# Altium project DM3370.PrjPcb (part 9 of 14)
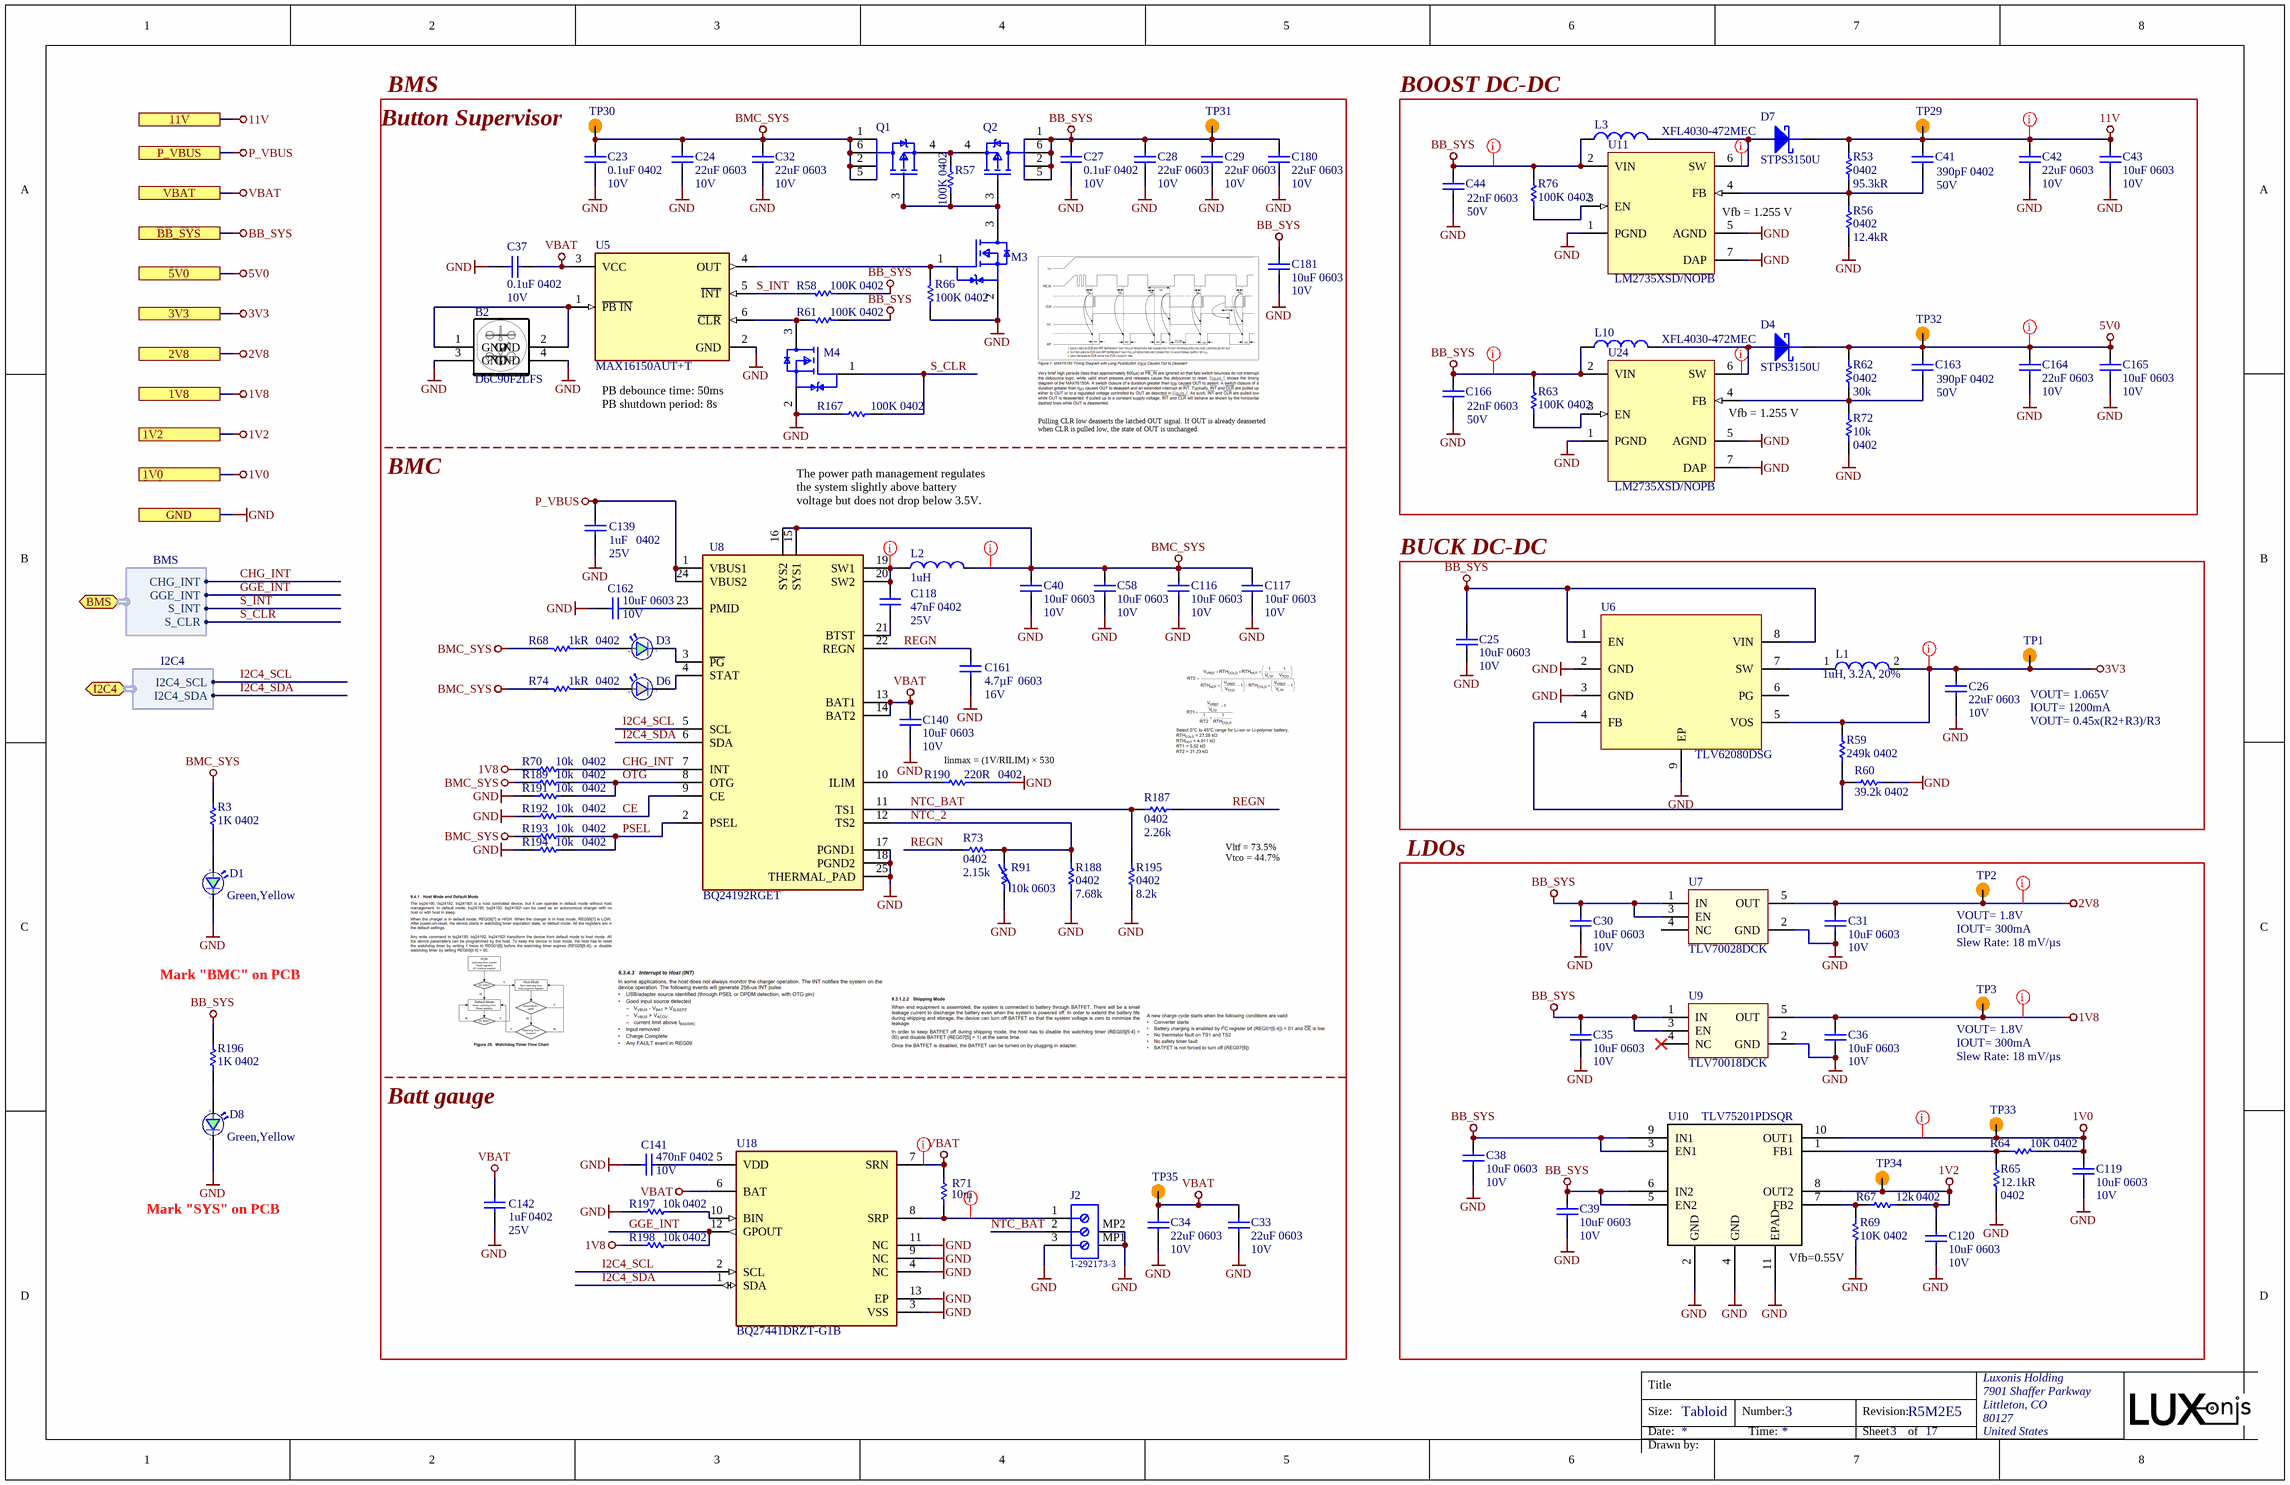
[diagram p117: DM3370_Power.SchDoc]

## Sheet DM3370_Power.SchDoc: =project_title (continued)
### Library data of the parts
B2 = CMP-002-00091-3: Keypad Switch, 1 Switches, SPST, Momentary-tactile, 0.1A, 32VDC, 2.5N, 4 PCB Hole Cnt, Solder Terminal, Through Hole-straight; Manufacturer Series: D6C; Manufacturer 1: C&K; Electrical Life: 250000Cycles; Actuator Type: SQUARE TYPE; Number of Switches: 1; Circuit Configuration: 1X1; Connector Type: Receptacle; Contact Bounce Time-Max: 10ms; Body Height: 5.8mm; Contact DC Max Rating R Load: .1A@32VDC; Body Length or Diameter: 12mm; Contact Current(DC)-Max: 100mA; Contact Voltage(DC)-Max: 32V; Manufacturer Part Number 1: D6C90F2LFS; Operating Force-Max: 2.5N; RoHS Compliant: No; Min Operating Temperature: -20°C; Switch Type: Keypad; Packaging: Bulk; REACH SVHC: No SVHC; Max Operating Temperature: 85°C; Switch Function: SPST; Termination: Solder; Switch Action: MOMENTARY-TACTILE; Mount: Through Hole
C23 C27 C37 = GRM155R71A104JA01D: CAP CER 0.1UF 10V X7R 0402 5%; Manufacturer 1: Murata; Capacitance: 100nF; Supplier 1: Digi-Key; Manufacturer Part Number 1: GRM155R71A104JA01D; Stock 1: 1346709; Pricing 1: 1=0.10000, 10=0.02500, 100=0.01130, 500=0.00806, 1000=0.00633, 2500=0.00575, 5000=0.00529 (USD); RoHS: Yes; Mount: Surface Mount; Case/Package: 0402; Case Code (Imperial): 0402; Case Code (Metric): 1005; Min Operating Temperature: -55°C; Max Operating Temperature: 125°C; Tolerance: 5%; Packaging: Tape and Reel; Voltage Rating (DC): 10V; Dielectric: X7R; Package Quantity: 10000; Termination: SMD/SMT; Length: 1mm; Height: 0.5mm; Width: 0.02inch; Thickness: 0.022inch; Depth: 0.5mm; Radiation Hardening: No; Lead Free: Lead Free; ComponentLink1URL: https://datasheet.ciiva.com/5411/product-5411135.pdf?src-supplier=Mouser; ComponentLink1Description: https://datasheet.ciiva.com/5411/product-5411135.pdf?src-supplier=Mouser; ComponentLink2URL: https://datasheet.ciiva.com/11618/c02e-11618821.pdf?src-supplier=Avnet; ComponentLink2Description: https://datasheet.ciiva.com/11618/c02e-11618821.pdf?src-supplier=Avnet; Supplier Part Number 1: 490-10777-1-ND
C24 C26 C28 C29 C32-C34 C42 C164 C180 = GRM188R61A226ME15D: CAP CER 22UF 10V X5R 0603 20%; Manufacturer 1: Murata; Material: Ceramic; ComponentLink1URL: https://datasheet.ciiva.com/46444/1769893-46444975.pdf?src-supplier=Element14; ComponentLink1Description: https://datasheet.ciiva.com/46444/1769893-46444975.pdf?src-supplier=Element14; Supplier 1: Digi-Key; Manufacturer Part Number 1: GRM188R61A226ME15D; Stock 1: 984716; Pricing 1: 1=0.31000, 10=0.21500, 100=0.12160, 500=0.08584, 1000=0.07512 (USD); RoHS: Yes; Mount: Surface Mount; Case/Package: 0603; Weight: 0.000222oz; Case Code (Metric): 1608; Case Code (Imperial): 0603; Min Operating Temperature: -55°C; Max Operating Temperature: 85°C; Capacitance: 22uF; Tolerance: 20%; Packaging: Tape and Reel; Dielectric: X5R; Voltage Rating (DC): 10V; Termination: SMD/SMT; Package Quantity: 4000; Length: 1.6mm; Height: 0.8mm; Width: 0.8mm; Thickness: 0.039inch; Depth: 0.8mm; REACH SVHC: No SVHC; Lead Free: Lead Free; Supplier Part Number 1: 490-10476-1-ND
C25 C30 C31 C35 C36 C38-C40 C43 C58 C116 C117 C119 C120 C140 C162 C165 C181 = GRM188R61A106ME69D: CAP CER 10UF 10V X5R 0603 20%; Manufacturer 1: Murata; Material: Ceramic; Supplier 1: Digi-Key; Manufacturer Part Number 1: GRM188R61A106ME69D; Stock 1: 2873098; Pricing 1: 1=0.21000, 10=0.14100, 100=0.07130, 500=0.04876, 1000=0.04313 (USD); RoHS: Yes; Mount: Surface Mount; Case/Package: 0603; Weight: 0.000222oz; Case Code (Metric): 1608; Case Code (Imperial): 0603; Min Operating Temperature: -55°C; Max Operating Temperature: 85°C; Packaging: Tape and Reel; Tolerance: 20%; Capacitance: 10uF; Dielectric: X5R; Voltage Rating (DC): 10V; Package Quantity: 4000; Termination: SMD/SMT; Length: 1.6mm; Height: 0.8mm; Width: 0.8mm; Thickness: 0.035inch; Depth: 0.8mm; REACH SVHC: Unknown; Lead Free: Lead Free; ComponentLink1URL: http://www.mouser.com/ds/2/281/c02e-2905.pdf?src-supplier=Mouser; ComponentLink1Description: http://www.mouser.com/ds/2/281/c02e-2905.pdf?src-supplier=Mouser; ComponentLink2URL: http://components.arrow.com/part/dataview/0323_06119472?src-supplier=Arrow+Europe; ComponentLink2Description: http://components.arrow.com/part/dataview/0323_06119472?src-supplier=Arrow+Europe; ComponentLink3URL: http://www.farnell.com/datasheets/2048014.pdf?src-supplier=Farnell; ComponentLink3Description: http://www.farnell.com/datasheets/2048014.pdf?src-supplier=Farnell; ComponentLink4URL: http://www.farnell.com/datasheets/1872210.pdf?src-supplier=Farnell; ComponentLink4Description: http://www.farnell.com/datasheets/1872210.pdf?src-supplier=Farnell; ComponentLink5URL: http://search.murata.co.jp/Ceramy/image/img/A01X/G101/ENG/GRM188R61A106ME69-01.pdf?src-supplier=Digi-Key; ComponentLink5Description: http://search.murata.co.jp/Ceramy/image/img/A01X/G101/ENG/GRM188R61A106ME69-01.pdf?src-supplier=Digi-Key; ComponentLink6URL: http://www.farnell.com/datasheets/1872210.pdf?src-supplier=Newark; ComponentLink6Description: http://www.farnell.com/datasheets/1872210.pdf?src-supplier=Newark; ComponentLink7URL: http://www.farnell.com/datasheets/2048014.pdf?src-supplier=Element14; ComponentLink7Description: http://www.farnell.com/datasheets/2048014.pdf?src-supplier=Element14; ComponentLink8URL: http://www.farnell.com/datasheets/2048014.pdf?src-supplier=Newark; ComponentLink8Description: http://www.farnell.com/datasheets/2048014.pdf?src-supplier=Newark; Supplier Part Number 1: 490-10475-1-ND
C41 C163 = CMP-004-000029-1: CAP CER 390PF 50V C0G 0402; Manufacturer 1: Murata; Negative Tolerance: 5%; Capacitor Type: Ceramic; Multilayer: Yes; RoHS Compliant: Yes; Packaging: Tape and Reel; Width: 0.5mm; ComponentLink2URL: https://datasheet.ciiva.com/6270/product-6270768.pdf?src-supplier=Digi-Key; Category: Ceramic Capacitors; Height: 0.5mm; Design Item ID: GRM1555C1H391JA01J; RoHS: Yes; ComponentLink3Description: https://datasheet.ciiva.com/6270/partnumbering-e-01-6270809.pdf?src-supplier=Digi-Key; Manufacturer Part Number 1: GRM1555C1H391JA01J; Max Operating Temperature: 125°C; Length: 1mm; Dielectric Material: Ceramic; JESD-609 Code: e3; REACH SVHC: Yes; Mount: Surface Mount; Source: LuxonisMaster.SchLib; ComponentLink2Description: https://datasheet.ciiva.com/6270/product-6270768.pdf?src-supplier=Digi-Key; Termination: Wraparound; Terminal Finish: Nickel; ComponentLink3URL: https://datasheet.ciiva.com/6270/partnumbering-e-01-6270809.pdf?src-supplier=Digi-Key; Positive Tolerance: 5%; ComponentLink1Description: https://datasheet.ciiva.com:443/pdfs/VipMasterIC/IC/MURE/MURE-S-A0004280628/MURE-S-A0004346975-1.pdf?src-supplier=IHS+Markit; Pricing 1: 1=0,10000, 10=0,07100, 50=0,03900, 100=0,03180, 500=0,02272, 1000=0,01785, 2500=0,01622, 5000=0,01493 (USD); Package Style: SMTMeter; Temperature Characteristics Code: C0G; Number of Pins: 2; Package Shape: Rectangular; Stock 1: 73655; ComponentLink1URL: https://datasheet.ciiva.com:443/pdfs/VipMasterIC/IC/MURE/MURE-S-A0004280628/MURE-S-A0004346975-1.pdf?src-supplier=IHS+Markit; Min Operating Temperature: -55°C
C44 C166 = CMP-004-000000-1: CAP CER 0.022UF 50V X7R 0603; Manufacturer 1: KEMET; Dissipation Factor: 2.5%; Dielectric Material: Ceramic; Tolerance: 10%; Depth: 0.8mm; Package Quantity: 4000; Radiation Hardening: No; ComponentLink1Description: https://datasheet.ciiva.com/7823/1776091-7823698.pdf?src-supplier=Element14; Min Operating Temperature: -55°C; ComponentLink2URL: https://datasheet.ciiva.com/7824/kem-c1002-x7r-smd-7824021.pdf?src-supplier=Element14; Manufacturer Part Number 1: C0603C223K5RACTU; Mount: Surface Mount,PCB; Height: 0.8mm; Case Code (Metric): 1608; REACH SVHC: No SVHC; Width: 0.8mm; ComponentLink1URL: https://datasheet.ciiva.com/7823/1776091-7823698.pdf?src-supplier=Element14; ComponentLink2Description: https://datasheet.ciiva.com/7824/kem-c1002-x7r-smd-7824021.pdf?src-supplier=Element14; RoHS: Yes; Contact Plating: Tin,Matte; Stock 1: 77845; Dielectric: X7R; Thickness: 0.034inch; Source: LuxonisMaster.SchLib; Voltage: 50V; Voltage Rating (DC): 50V; Design Item ID: C0603C223K5RACTU; Number of Pins: 2; Case/Package: 0603; Length: 1.6mm; Pricing 1: 1=0.10000, 10=0.06400, 100=0.02850, 500=0.02036, 1000=0.01600 (USD); Packaging: Tape and Reel; Lead Pitch: 0.7mm; Max Operating Temperature: 125°C; Termination: SMD/SMT
C118 = CMP-004-000014-1: CAP CER 0.047UF 25V X7R 0402 10%; Manufacturer 1: Murata; Material: Ceramic; Voltage Rating: 25V; Manufacturer Part Number: GRM155R71E473KA88D; Manufacturer Part Number 1: GRM155R71E473KA88D; ComponentLink11Description: https://datasheet.ciiva.com/5424/product-5424844.pdf?src-supplier=Mouser; ComponentLink11URL: https://datasheet.ciiva.com/5424/product-5424844.pdf?src-supplier=Mouser; ComponentLink4Description: https://datasheet.ciiva.com/18184/getdatasheetpartid-153136-18184712.pdf?src-supplier=Verical; Thickness: 0.022inch; ComponentLink3Description: https://datasheet.ciiva.com/34302/1856425-34302854.pdf?src-supplier=Jameco; ComponentLink5Description: https://datasheet.ciiva.com/29199/454180-da-01-en-vs-kondensator-0402-29199826.pdf?src-supplier=Conrad; RoHS: Yes; Package Quantity: 1; Manufacturer: Murata; ComponentLink12Description: https://datasheet.ciiva.com/16213/product-16213823.pdf?src-supplier=Future+Electronics; REACH SVHC: No SVHC; ComponentLink12URL: https://datasheet.ciiva.com/16213/product-16213823.pdf?src-supplier=Future+Electronics; Source: LuxonisMaster.SchLib; Width: 0.02inch; ComponentLink5URL: https://datasheet.ciiva.com/29199/454180-da-01-en-vs-kondensator-0402-29199826.pdf?src-supplier=Conrad; Case Code (Metric): 1005; Stock 1: 1130633; Radiation Hardening: No; ComponentLink9URL: https://datasheet.ciiva.com/7937/608985-7937623.pdf?src-supplier=Element14; ComponentLink2Description: https://datasheet.ciiva.com/131/grm155r71e473ka88-01-131494.pdf?src-supplier=Digi-Key; Tolerance: 10%; Case/Package: 0402; Termination: SMD/SMT; Pricing 1: 1=0.10000, 10=0.06300, 100=0.02820, 500=0.02012, 1000=0.01581, 2500=0.01438, 5000=0.01323 (USD); ComponentLink10URL: https://datasheet.ciiva.com/14103/grmseries-highdielectrictype-eng-14103754.pdf?src-supplier=Distrelec; ComponentLink3URL: https://datasheet.ciiva.com/34302/1856425-34302854.pdf?src-supplier=Jameco; Min Operating Temperature: -55°C; Lead Free: Lead Free; Dielectric: X7R; ComponentLink8URL: https://datasheet.ciiva.com/131/grm155r71e473ka88-01-131493.pdf?src-supplier=Digi-Key; Packaging: Tape and Reel; ComponentLink7URL: https://datasheet.ciiva.com/131/grm155r71e473ka88-01-131492.pdf?src-supplier=Digi-Key; ComponentLink6URL: https://datasheet.ciiva.com/2989/product-2989395.pdf?src-supplier=Avnet; ComponentLink7Description: https://datasheet.ciiva.com/131/grm155r71e473ka88-01-131492.pdf?src-supplier=Digi-Key; Mount: Surface Mount; ComponentLink4URL: https://datasheet.ciiva.com/18184/getdatasheetpartid-153136-18184712.pdf?src-supplier=Verical; Length: 1mm; Design Item ID: GRM155R71E473KA88D; ComponentLink10Description: https://datasheet.ciiva.com/14103/grmseries-highdielectrictype-eng-14103754.pdf?src-supplier=Distrelec; ComponentLink6Description: https://datasheet.ciiva.com/2989/product-2989395.pdf?src-supplier=Avnet; Height: 0.5mm; Voltage Rating (DC): 25V; ComponentLink1URL: https://datasheet.ciiva.com/17455/product-17455616.pdf?src-supplier=Avnet+Europe; Max Operating Temperature: 125°C; ComponentLink1Description: https://datasheet.ciiva.com/17455/product-17455616.pdf?src-supplier=Avnet+Europe; ComponentLink2URL: https://datasheet.ciiva.com/131/grm155r71e473ka88-01-131494.pdf?src-supplier=Digi-Key; Number of Pins: 2; Depth: 0.5mm; ComponentLink8Description: https://datasheet.ciiva.com/131/grm155r71e473ka88-01-131493.pdf?src-supplier=Digi-Key; ComponentLink9Description: https://datasheet.ciiva.com/7937/608985-7937623.pdf?src-supplier=Element14
C139 C142 = CMP-108-000014-1: CAP CER 1UF 25V X5R 0402 10%; Manufacturer 1: Murata; Material: Ceramic; Voltage Rating: 25V; Package Quantity: 10000; Width: 0.5mm; Termination: SMD/SMT; RoHS: Yes; Dielectric: X5R; Min Operating Temperature: -55°C; Packaging: Tape and Reel; ComponentLink1URL: https://datasheet.ciiva.com/22732/1666664-22732122.pdf?src-supplier=Element14; Thickness: 0.022inch; ComponentLink1Description: https://datasheet.ciiva.com/22732/1666664-22732122.pdf?src-supplier=Element14; ComponentLink2Description: https://datasheet.ciiva.com/7719/1666664-7719006.pdf?src-supplier=Element14; Case Code (Metric): 1005; Mount: Surface Mount; Weight: 0.000212oz; Tolerance: 10%; Length: 1mm; Max Operating Temperature: 85°C; Source: BW2098POE_1.SCHLIB; ComponentLink2URL: https://datasheet.ciiva.com/7719/1666664-7719006.pdf?src-supplier=Element14; Depth: 0.5mm; Case/Package: 0402; Manufacturer Part Number 1: GRM155R61E105KA12D; Voltage Rating (DC): 25V; Pricing 1: 1=0.10000, 10=0.07100, 100=0.03350, 500=0.02352, 1000=0.01947, 2500=0.01812, 5000=0.01658 (USD); REACH SVHC: No SVHC; Lead Free: Lead Free; Design Item ID: GRM155R61E105KA12D; Stock 1: 200653; Height: 0.5mm
C141 = CMP-004-000030-1: CAP CER 0.47UF 10V X5R 0402; Manufacturer 1: Murata; Tolerance: 10%; Material: Ceramic; Dissipation Factor: 0.1%; ComponentLink3URL: https://datasheet.ciiva.com/11786/0900766b80ef921d-11786226.pdf?src-supplier=RSComponents; Series: GRM; ComponentLink7URL: https://datasheet.ciiva.com/7719/1747445-7719005.pdf?src-supplier=Element14; Length: 1mm; ComponentLink5Description: https://datasheet.ciiva.com/29200/453533-da-01-en-vs-kondensator-0402-29200100.pdf?src-supplier=Conrad; ComponentLink6URL: https://datasheet.ciiva.com/14116/grmseries-highdielectrictype-eng-14116874.pdf?src-supplier=Distrelec; Height: 0.5mm; ComponentLink2Description: https://datasheet.ciiva.com/164/product-164992.pdf?src-supplier=Digi-Key; Mount: Surface Mount; ComponentLink11Description: https://datasheet.ciiva.com/2989/product-2989371.pdf?src-supplier=Avnet; ComponentLink12URL: https://datasheet.ciiva.com/16199/product-16199863.pdf?src-supplier=Future+Electronics; ComponentLink6Description: https://datasheet.ciiva.com/14116/grmseries-highdielectrictype-eng-14116874.pdf?src-supplier=Distrelec; ComponentLink12Description: https://datasheet.ciiva.com/16199/product-16199863.pdf?src-supplier=Future+Electronics; Source: LuxonisMaster.SchLib; Lead Free: Lead Free; ComponentLink10Description: https://datasheet.ciiva.com/164/grm155r61a474ke15-01-164994.pdf?src-supplier=Digi-Key; REACH SVHC: No SVHC; Package Quantity: 10000; Design Item ID: GRM155R61A474KE15D; ComponentLink4URL: https://datasheet.ciiva.com/18184/getdatasheetpartid-137366-18184609.pdf?src-supplier=Verical; ComponentLink9Description: https://datasheet.ciiva.com/164/grm155r61a474ke15-01-164993.pdf?src-supplier=Digi-Key; ComponentLink4Description: https://datasheet.ciiva.com/18184/getdatasheetpartid-137366-18184609.pdf?src-supplier=Verical; ComponentLink1URL: https://datasheet.ciiva.com/6068/1747445-6068308.pdf?src-supplier=Farnell; Case Code (Metric): 1005; ComponentLink3Description: https://datasheet.ciiva.com/11786/0900766b80ef921d-11786226.pdf?src-supplier=RSComponents; RoHS Compliant: Yes; Construction: Flat; ComponentLink9URL: https://datasheet.ciiva.com/164/grm155r61a474ke15-01-164993.pdf?src-supplier=Digi-Key; Stock 1: 10000; Width: 0.02inch; Pricing 1: 10000=0,01214, 20000=0,01179, 40000=0,01144 (USD); Min Operating Temperature: -55°C; ComponentLink7Description: https://datasheet.ciiva.com/7719/1747445-7719005.pdf?src-supplier=Element14; Voltage Rating (DC): 10V; Case Code (Imperial): 0402; Voltage: 10V; Manufacturer Part Number 1: GRM155R61A474KE15D; Category: Ceramic Capacitors; ComponentLink11URL: https://datasheet.ciiva.com/2989/product-2989371.pdf?src-supplier=Avnet; Number of Pins: 2; ComponentLink2URL: https://datasheet.ciiva.com/164/product-164992.pdf?src-supplier=Digi-Key; ComponentLink5URL: https://datasheet.ciiva.com/29200/453533-da-01-en-vs-kondensator-0402-29200100.pdf?src-supplier=Conrad; Radiation Hardening: No; Max Operating Temperature: 85°C; ComponentLink8URL: https://datasheet.ciiva.com/22698/1747445-22698412.pdf?src-supplier=Element14; ComponentLink8Description: https://datasheet.ciiva.com/22698/1747445-22698412.pdf?src-supplier=Element14; ComponentLink10URL: https://datasheet.ciiva.com/164/grm155r61a474ke15-01-164994.pdf?src-supplier=Digi-Key; Thickness: 0.022inch; ComponentLink1Description: https://datasheet.ciiva.com/6068/1747445-6068308.pdf?src-supplier=Farnell; Termination: SMD/SMT; Depth: 0.5mm; Packaging: Tape and Reel; Dielectric: X5R; RoHS: Yes
C161 = CMP-004-000020-2: CAP CER 4.7UF 16V X5R 0603 10%; Manufacturer 1: Murata; Manufacturer Part Number 1: GRM188R61C475KAAJD; Tolerance: 10%; Design Item ID: GRM188R61C475KAAJD; Manufacturer 2: Murata; Height: 0.8mm; ComponentLink1Description: https://datasheet.ciiva.com/14813/595grm188r61c475kaaj23-14813668.pdf?src-supplier=Arrow; Manufacturer 3: Murata; ComponentLink1URL: https://datasheet.ciiva.com/14813/595grm188r61c475kaaj23-14813668.pdf?src-supplier=Arrow; Dielectric: X5R; Manufacturer Part Number 3: GRM188R61C475KAAJD; Depth: 0.8mm; Max Operating Temperature: 85°C; Manufacturer Part Number 2: GRM188R61C475KAAJD; Length: 1.6mm; Width: 0.8mm; Min Operating Temperature: -55°C; Mounting Technology: SMT
D1 D8 = CMP-111-000004-2: LED GREEN DIFFUSED 0603 SMD Green 572nm LED Indication - Discrete 2.2V 0603 (1608 Metric); Manufacturer 1: Rohm; Forward Current: 20mA; Min Operating Temperature: -40°C; Forward Voltage: 2.2V; Max Operating Temperature: 85°C; Case/Package: 0603; Manufacturer Part Number 1: SML-D12M8WT86
D3 = CMP-111-000004-1: LED GREEN DIFFUSED 0603 SMD Green 572nm LED Indication - Discrete 2.2V 0603 (1608 Metric); Manufacturer 1: Rohm; Test Current: 20mA; Viewing Angle: 160°; Lens Color: White,Diffused; Colour: Green,Yellow; Lens Style: Diffused,Colorless,Rectangular; Luminous Intensity: 25mcd; Lens Colour: White,Clear,Diffused; Number of LEDs: 1; ComponentLink10Description: https://datasheet.ciiva.com/2110/sml-d1-2110398.pdf?src-supplier=Digi-Key; Case Code (Imperial): 0603; Packaging: Tape and Reel; Mount: Surface Mount; Illumination Colour: Green; Min Operating Temperature: -40°C; ComponentLink5URL: https://datasheet.ciiva.com/2110/sml-d1-2110398.pdf; ComponentLink4Description: https://datasheet.ciiva.com/2110/sml-d1-2110397.pdf; Forward Current: 20mA; ComponentLink6URL: https://datasheet.ciiva.com/11774/0900766b80df3ada-11774260.pdf?src-supplier=RSComponents; Width: 0.8mm; Dominant Wavelength: 572nm; RoHS: Yes; ComponentLink7URL: https://datasheet.ciiva.com/3161/sml-d1-3161419.pdf?src-supplier=Avnet; Number of Pins: 2; ComponentLink1URL: https://datasheet.ciiva.com/11774/0900766b80df3ada-11774260.pdf; ComponentLink10URL: https://datasheet.ciiva.com/2110/sml-d1-2110398.pdf?src-supplier=Digi-Key; ComponentLink2Description: https://datasheet.ciiva.com/3161/sml-d1-3161419.pdf; Package Quantity: 1; Manufacturer Part Number 1: SML-D12M8WT86; Lens Transparency: Diffused; Height: 0.65mm; Case/Package: 0603; Manufacturer Part Number: SML-D12M8WT86; ComponentLink2URL: https://datasheet.ciiva.com/3161/sml-d1-3161419.pdf; ComponentLink9Description: https://datasheet.ciiva.com/2110/sml-d1-2110397.pdf?src-supplier=Digi-Key; Pricing 1: 1=0.33000, 10=0.23900, 100=0.11340, 500=0.07560, 1000=0.05922 (USD); ComponentLink8URL: https://datasheet.ciiva.com/2110/sml-d1-2110396.pdf?src-supplier=Digi-Key; ComponentLink7Description: https://datasheet.ciiva.com/3161/sml-d1-3161419.pdf?src-supplier=Avnet; Lead Free: Lead Free; Wavelength: 572nm; ComponentLink8Description: https://datasheet.ciiva.com/2110/sml-d1-2110396.pdf?src-supplier=Digi-Key; ComponentLink9URL: https://datasheet.ciiva.com/2110/sml-d1-2110397.pdf?src-supplier=Digi-Key; Source: BW2098POE_1.SCHLIB; Max Operating Temperature: 85°C; ComponentLink4URL: https://datasheet.ciiva.com/2110/sml-d1-2110397.pdf; ComponentLink1Description: https://datasheet.ciiva.com/11774/0900766b80df3ada-11774260.pdf; ComponentLink3URL: https://datasheet.ciiva.com/2110/sml-d1-2110396.pdf; Design Item ID: SML-D12M8WT86; Color: Green,Yellow; Manufacturer: Rohm; Radiation Hardening: No; Illumination Color: Green; ComponentLink3Description: https://datasheet.ciiva.com/2110/sml-d1-2110396.pdf; ComponentLink6Description: https://datasheet.ciiva.com/11774/0900766b80df3ada-11774260.pdf?src-supplier=RSComponents; Stock 1: 112971; Length: 1.6mm; Case Code (Metric): 1608; ComponentLink5Description: https://datasheet.ciiva.com/2110/sml-d1-2110398.pdf; Forward Voltage: 2.2V; REACH SVHC: Unknown
D4 D7 = STPS3150U: DIODE SCHOTTKY 150V 3A SMB; Manufacturer 1: STMicroelectronics; Standoff Height: 0.05mm; Max Junction Temp: +175°C; Peak Reverse Current: 0.4uA; Max Surge Forward Current: 80A; Max Repetitive Reverse Voltage: 150V; Device Class L3: Schottky Diodes; Temperature Range High: +175°C; Digikey Description: DIODE SCHOTTKY 150V 3A SMB; ComponentLink2Description: Datasheet; ComponentLink2URL: https://www.st.com/resource/en/datasheet/stps3150.pdf; Category: Diode; Manufacturer Part Number 1: STPS3150U; Package: SMB; Mouser Description: Schottky Diodes & Rectifiers 3.0 Amp 150 Volt; Octopart: https://octopart.com/stps3150u-stmicroelectronics-39552976; Temperature: to +175°C; Device Class L2: Diodes; Height: 2.65mm; RoHS: TRUE; Lead Free: Yes; Forward Current: 3A; Device Class L1: Discrete Semiconductors; Automotive: No; Manufacturer: STMicroelectronics; Manufacturer Part Number: STPS3150U
D6 = CMP-111-000003-1: LED ORANGE DIFFUSED 0603 SMD Orange 605nm LED Indication - Discrete 2.2V 0603 (1608 Metric); Manufacturer 1: Rohm; Lens Style: Diffused,Colorless,Rectangular; Forward Current: 20mA; Luminous Intensity: 100mcd; Number of LEDs: 1; Viewing Angle: 160°; Lens Color: White; Design Item ID: SML-D12D8WT86; ComponentLink6Description: https://datasheet.ciiva.com/17419/sml-d1-17419886.pdf?src-supplier=Avnet+Europe; Number of Pins: 2; ComponentLink5Description: https://datasheet.ciiva.com/2115/sml-d1-2115579.pdf?src-supplier=Digi-Key; Manufacturer Part Number 1: SML-D12D8WT86; Min Operating Temperature: -40°C; Illumination Color: Orange; Pricing 1: 1=0.33000, 10=0.23900, 100=0.11340, 500=0.07560, 1000=0.05922 (USD); Stock 1: 29355; ComponentLink1Description: https://datasheet.ciiva.com/2115/sml-d1-2115577.pdf?src-supplier=Digi-Key; Width: 0.8mm; ComponentLink4Description: https://datasheet.ciiva.com/16387/sml-d1-16387850.pdf?src-supplier=Future+Electronics; Package Quantity: 1; ComponentLink1URL: https://datasheet.ciiva.com/2115/sml-d1-2115577.pdf?src-supplier=Digi-Key; Case Code (Metric): 1608; Case Code (Imperial): 0603; Test Current: 20mA; ComponentLink4URL: https://datasheet.ciiva.com/16387/sml-d1-16387850.pdf?src-supplier=Future+Electronics; Height: 0.65mm; Forward Voltage: 2.2V; ComponentLink3URL: https://datasheet.ciiva.com/3161/sml-d1-3161418.pdf?src-supplier=Avnet; Wavelength: 605nm; ComponentLink3Description: https://datasheet.ciiva.com/3161/sml-d1-3161418.pdf?src-supplier=Avnet; Length: 1.6mm; Radiation Hardening: No; ComponentLink2Description: https://datasheet.ciiva.com/2115/sml-d1-2115578.pdf?src-supplier=Digi-Key; ComponentLink6URL: https://datasheet.ciiva.com/17419/sml-d1-17419886.pdf?src-supplier=Avnet+Europe; Lens Transparency: Diffused; Dominant Wavelength: 605nm; Case/Package: 0603; ComponentLink2URL: https://datasheet.ciiva.com/2115/sml-d1-2115578.pdf?src-supplier=Digi-Key; Source: BW2098POE_1.SCHLIB; Packaging: Tape and Reel; Max Operating Temperature: 85°C; RoHS: Yes; ComponentLink5URL: https://datasheet.ciiva.com/2115/sml-d1-2115579.pdf?src-supplier=Digi-Key; REACH SVHC: Unknown; Mount: Surface Mount; Lead Free: Lead Free; Color: Orange
J2 = CMP-002-00117-1: Board Connector, 3 Contact(s), 1 Row(s), Male, Right Angle, Surface Mount Terminal; Manufacturer 1: TE Connectivity; Manufacturer Part Number 1: 1-292173-3; RoHS Compliant: Yes; Connector Type: BOARD CONNECTOR
L1 = DFE252012P-1R0M=P2: FIXED IND 1UH 3.2A 42 MOHM SMD; Manufacturer: Murata; Core Material: Ferrite; Current Rating: 4.3A; Shielding: Shielded; Test Frequency: 1MHz; DC Resistance (DCR): 42mR; Manufacturer Part Number: DFE252012P-1R0M=P2; RoHS: Yes; Mount: Surface Mount; Case/Package: 1008; Case Code (Metric): 2520; Min Operating Temperature: -40°C; Max Operating Temperature: 125°C; Packaging: Tape and Reel; Composition: Wirewound; Length: 0.098inch; Width: 0.079inch; Height - Seated (Max): 0.039inch; Depth: 2mm; ComponentLink1URL: http://www.farnell.com/datasheets/2550134.pdf?src-supplier=Farnell; ComponentLink1Description: http://www.farnell.com/datasheets/2550134.pdf?src-supplier=Farnell; ComponentLink2URL: https://www.murata.com/~/media/webrenewal/products/inductor/chip/tokoproducts/wirewoundmetalalloychiptype/m_dfe252012p.ashx?src-supplier=Digi-Key; ComponentLink2Description: https://www.murata.com/~/media/webrenewal/products/inductor/chip/tokoproducts/wirewoundmetalalloychiptype/m_dfe252012p.ashx?src-supplier=Digi-Key; ComponentLink3URL: http://www.murata.com/~/media/webrenewal/products/inductor/chip/tokoproducts/wirewoundmetalalloychiptype/m_dfe252012p.ashx?src-supplier=Digi-Key; ComponentLink3Description: http://www.murata.com/~/media/webrenewal/products/inductor/chip/tokoproducts/wirewoundmetalalloychiptype/m_dfe252012p.ashx?src-supplier=Digi-Key; ComponentLink4URL: http://www.toko.co.jp/products/pdf/inductors/dfe252012p.pdf?src-supplier=Avnet; ComponentLink4Description: http://www.toko.co.jp/products/pdf/inductors/dfe252012p.pdf?src-supplier=Avnet; Supplier 1: Digi-Key; Manufacturer 1: Murata; Manufacturer Part Number 1: DFE252012P-1R0M=P2; Stock 1: 2560; Pricing 1: 1=0.43000, 10=0.37800, 100=0.27030, 500=0.22702, 1000=0.18377 (USD); Supplier Part Number 1: 490-10647-1-ND; Max DC Current: 3.2A; Tolerance: 20%; Case Code (Imperial): 1008; Supplier 2: Digi-Key; Manufacturer 2: Murata; Manufacturer Part Number 2: DFE252012P-1R0M=P2; Stock 2: 95; Pricing 2: 1=0.43000, 10=0.37800, 100=0.27030, 500=0.22702, 1000=0.18377 (USD); Supplier 3: Mouser; Manufacturer 3: Murata; Manufacturer Part Number 3: DFE252012P-1R0M=P2; Stock 3: 667; Pricing 3: 1=0.43000, 10=0.37900, 50=0.37900, 100=0.27000, 1000=0.18400, 10000=0.14600 (USD); Supplier 4: Element14; Manufacturer 4: Murata; Manufacturer Part Number 4: DFE252012P-1R0M=P2; Stock 4: 41; Pricing 4: 1=0.64000, 10=0.56500, 100=0.40500, 500=0.34000, 1000=0.27500 (SGD); Supplier Part Number 4: 2530071; Supplier Part Number 3: 81-DFE252012P-1R0MP2; Supplier Part Number 2: 490-10647-6-ND; Inductance: 1uH
L2 = CMP-009-000005-1: Fixed Inductors 11A 11.9mR XFL4020; Manufacturer 1: Coilcraft; Self Resonant Frequency: 64MHz; Tolerance: 20%; Available Preview Images: 2D; Shielding: Shielded; Test Frequency: 100kHz; Saturation Current: 4.5A; Core Material: Composite; Max Operating Temperature: 125°C; DC Resistance (DCR): 11.9mR; ComponentLink1Description: https://datasheet.ciiva.com/22679/1682010-22679273.pdf?src-supplier=Element14; ComponentLink3Description: https://datasheet.ciiva.com/13168/xfl4020-13168079.pdf?src-supplier=Mouser; Series: XFL4020; ComponentLink2URL: https://datasheet.ciiva.com/22679/1682010-22679274.pdf?src-supplier=Element14; RMS Current (Irms): 11A; Termination: SMD/SMT; Design Item ID: XFL4020-102MEC; ComponentLink3URL: https://datasheet.ciiva.com/13168/xfl4020-13168079.pdf?src-supplier=Mouser; Stock 1: 169060; Min Operating Temperature: -40°C; ComponentLink2Description: https://datasheet.ciiva.com/22679/1682010-22679274.pdf?src-supplier=Element14; Inductance Tolerance: 20%; Width: 4.3mm; RoHS: Yes; Manufacturer Part Number 1: XFL4020-102MEC; Max DC Current: 11A; Packaging: Tape and Reel; Category: Fixed Inductors; REACH SVHC: No SVHC; Length: 4.3mm; Height: 2.1mm; Mount: Surface Mount; RoHS Compliant: Yes; Case/Package: SMD/SMT; Lead Free: Contains Lead; ComponentLink1URL: https://datasheet.ciiva.com/22679/1682010-22679273.pdf?src-supplier=Element14; Source: LuxonisMaster.SchLib; Pricing 1: 1=2,48000, 10=2,48000, 50=2,48000, 100=2,02000, 250=1,66000, 500=1,03000, 1000=0,94500, 10000=0,94500 (USD)
L3 L10 = XFL4030-472MEC: Fixed Inductors 5.7A 25mR XFL4030; Manufacturer 1: Coilcraft; Supplier 1: Mouser; Manufacturer Part Number 1: XFL4030-472MEC; RoHS: Yes; Category: Inductors; Stock 1: 2311; Pricing 1: 1=2,36000, 10=2,32000, 50=2,32000, 100=1,90000, 250=1,48000, 500=1,32000, 1000=1,21000, 2500=1,13000, 10000=1,13000 (USD); RoHS Compliant: Yes; Supplier Part Number 1: 994-XFL4030-472MEC
M3 M4 = RE1C002UNTCL: MOSFET N-CH 20V 0.2A EMT3; Manufacturer 1: Rohm; Continuous Drain Current (ID): 200mA; Rds On Max: 1.2R; Input Capacitance: 25pF; Max Power Dissipation: 150mW; RoHS: Yes; Mount: Surface Mount; Case/Package: SOT-89; Packaging: Tape and Reel; Drain to Source Voltage (Vdss): 20V; Lead Free: Lead Free; ComponentLink1URL: http://www.mouser.com/ds/2/348/re1c002untcl-e-1018231.pdf?src-supplier=Mouser; ComponentLink1Description: http://www.mouser.com/ds/2/348/re1c002untcl-e-1018231.pdf?src-supplier=Mouser; ComponentLink2URL: http://rohmfs.rohm.com/en/techdata_basic/transistor/taping/EMT3_TL_taping.pdf?src-supplier=Digi-Key; ComponentLink2Description: http://rohmfs.rohm.com/en/techdata_basic/transistor/taping/EMT3_TL_taping.pdf?src-supplier=Digi-Key; ComponentLink3URL: http://rohmfs.rohm.com/en/products/databook/datasheet/discrete/transistor/mosfet/re1c002un.pdf?src-supplier=Avnet; ComponentLink3Description: http://rohmfs.rohm.com/en/products/databook/datasheet/discrete/transistor/mosfet/re1c002un.pdf?src-supplier=Avnet; ComponentLink4URL: https://www.rohm.com/datasheet/RE1C002UN/re1c002untcl-e?src-supplier=Digi-Key; ComponentLink4Description: https://www.rohm.com/datasheet/RE1C002UN/re1c002untcl-e?src-supplier=Digi-Key; ComponentLink5URL: http://www.farnell.com/datasheets/2704376.pdf?src-supplier=Newark; ComponentLink5Description: http://www.farnell.com/datasheets/2704376.pdf?src-supplier=Newark; ComponentLink6URL: http://www.farnell.com/datasheets/2704376.pdf?src-supplier=Farnell; ComponentLink6Description: http://www.farnell.com/datasheets/2704376.pdf?src-supplier=Farnell; ComponentLink7URL: http://www.farnell.com/datasheets/2704376.pdf?src-supplier=Element14; ComponentLink7Description: http://www.farnell.com/datasheets/2704376.pdf?src-supplier=Element14; Supplier 1: Digi-Key; Manufacturer Part Number 1: RE1C002UNTCL; Stock 1: 868886; Pricing 1: 1=0.20000, 10=0.18200, 100=0.09930, 500=0.06112, 1000=0.04167 (USD); Supplier Part Number 1: RE1C002UNTCLCT-ND
Q1 Q2 = CMP-016-000020-1: MOSFET P-CH 20V 6.9A 6TSOP; Manufacturer 1: Infineon; Drain to Source Voltage (Vdss): -20V; Rise Time: 18ns; Max Power Dissipation: 2W; Gate to Source Voltage (Vgs): 12V; Input Capacitance: 905pF; Rds On Max: 32mR; Threshold Voltage: -400mV; Mount: Surface Mount; Min Operating Temperature: -55°C; Source: LuxonisMaster.SchLib; Halogen Free: Halogen Free; Lead Free: Lead Free; Contact Plating: Tin; Case/Package: TSOP; Number of Pins: 6; Manufacturer Part Number 1: IRLTS2242TRPBF; Design Item ID: IRLTS2242TRPBF; Max Operating Temperature: 150°C; Packaging: Tape and Reel; Continuous Drain Current (ID): 6.9A; REACH SVHC: No SVHC; Max Dual Supply Voltage: -20V; RoHS Compliant: Yes
R3 R196 = RC0402FR-071KL: RES SMD 1K OHM 1% 1/16W 0402 1 kOhms ±1% 0.063W, 1/16W Chip Resistor 0402 (1005 Metric) Moisture Resistant Thick Film; Manufacturer 1: Yageo; Temperature Coefficient: 100ppm/°C; Power Rating: 62.5mW; Voltage Rating (DC): 50V; Resistance: 1kR; RoHS: Yes; Number of Pins: 2; Case Code (Imperial): 0402; Case Code (Metric): 1005; Min Operating Temperature: -55°C; Max Operating Temperature: 155°C; Packaging: Tape and Reel; Composition: Thick Film; Voltage Rating: 50V; Military Standard: Not; Termination: SMD/SMT; Length: 1mm; Height: 0.32mm; Width: 0.5mm; Depth: 0.5mm; Lead Free: Lead Free; REACH SVHC: Unknown; ComponentLink1URL: https://datasheet.ciiva.com/11819/0900766b80c66297-11819477.pdf?src-supplier=RSComponents; ComponentLink1Description: https://datasheet.ciiva.com/11819/0900766b80c66297-11819477.pdf?src-supplier=RSComponents; ComponentLink2URL: https://datasheet.ciiva.com/12666/pyu-rc0402-51-rohs-l-6-r-12666741.pdf?src-supplier=Mouser; ComponentLink2Description: https://datasheet.ciiva.com/12666/pyu-rc0402-51-rohs-l-6-r-12666741.pdf?src-supplier=Mouser; ComponentLink3URL: https://datasheet.ciiva.com/17063/pyu-rc0402-51-rohs-l-6-r-17063193.pdf?src-supplier=Future+Electronics; ComponentLink3Description: https://datasheet.ciiva.com/17063/pyu-rc0402-51-rohs-l-6-r-17063193.pdf?src-supplier=Future+Electronics; ComponentLink4URL: https://datasheet.ciiva.com/22747/1018594-22747513.pdf?src-supplier=Element14; ComponentLink4Description: https://datasheet.ciiva.com/22747/1018594-22747513.pdf?src-supplier=Element14; ComponentLink5URL: https://datasheet.ciiva.com/7849/1018594-7849869.pdf?src-supplier=Element14; ComponentLink5Description: https://datasheet.ciiva.com/7849/1018594-7849869.pdf?src-supplier=Element14; ComponentLink6URL: https://datasheet.ciiva.com/7983/1018594-7983502.pdf?src-supplier=Element14; ComponentLink6Description: https://datasheet.ciiva.com/7983/1018594-7983502.pdf?src-supplier=Element14; ComponentLink7URL: https://datasheet.ciiva.com/7849/1018594-7849871.pdf?src-supplier=Element14; ComponentLink7Description: https://datasheet.ciiva.com/7849/1018594-7849871.pdf?src-supplier=Element14; Supplier 1: Digi-Key; Manufacturer Part Number 1: RC0402FR-071KL; Stock 1: 60695854; Pricing 1: 1=0.10000, 10=0.01600, 100=0.00670, 1000=0.00301, 2500=0.00261, 5000=0.00215 (USD); Case/Package: 0402; Tolerance: 1%; Supplier Part Number 1: 311-1.00KLRCT-ND
R53 = CMP-013-000066-1: RES SMD 95.3K OHM 1% 1/16W 0402; Manufacturer 1: Vishay; Max Power Dissipation: 63mW; Voltage Rating: 50V; Temperature Coefficient: 100ppm/°C; Weight: 2.3E-05oz; Number of Pins: 2; Manufacturer Part Number 1: CRCW040295K3FKED; Stock 1: 12; Termination: SMD/SMT; ComponentLink2URL: https://datasheet.ciiva.com/22705/1697337-22705834.pdf?src-supplier=Element14; Depth: 0.5mm; Lead Free: Lead Free; Case Code (Metric): 1005; Voltage Rating (DC): 50V; Design Item ID: CRCW040295K3FKED; Packaging: Tape and Reel; Size Code: 0402; Power Rating: 63mW; Height: 0.35mm; Width: 0.5mm; Series: CRCW; Pricing 1: 1=0,10000, 10=0,03800, 100=0,01530, 1000=0,00686, 2500=0,00595, 5000=0,00492 (USD); ComponentLink2Description: https://datasheet.ciiva.com/22705/1697337-22705834.pdf?src-supplier=Element14; Category: Chip SMD Resistors; Length: 1mm; ComponentLink1URL: https://datasheet.ciiva.com/5543/dcrcwe3-109170-5543177.pdf?src-supplier=Mouser; RoHS: Yes; Tolerance: 1%; Source: LuxonisMaster.SchLib; Features: Automotive AEC-Q200; Package Quantity: 10000; Min Operating Temperature: -55°C; Radiation Hardening: No; Number of Terminations: 2; REACH SVHC: Unknown; Max Operating Temperature: 155°C; Resistance Tolerance: 1%; Resistor Type: Thick Film; ComponentLink1Description: https://datasheet.ciiva.com/5543/dcrcwe3-109170-5543177.pdf?src-supplier=Mouser; Contact Plating: Tin; Case/Package: 0402; RoHS Compliant: Yes; Military Standard: Not; Construction: Rectangular
R56 = CMP-013-000038-2: RES SMD 12.4K OHM 1% 1/16W 0402; Manufacturer 1: Yageo; Power Rating: 62.5mW; Voltage Rating: 50V; Max Power Dissipation: 63mW; Case Code (Metric): 1005; Case/Package: 0402; Manufacturer Part Number 1: RC0402FR-0712K4L; Min Operating Temperature: -55°C; Max Operating Temperature: 155°C; Tolerance: 1%; Length: 1mm; Height: 0.016inch; Depth: 0.5mm; Design Item ID: RC0402FR-0712K4L
R57 R58 R61 R63 R66 R76 R167 = RC0402FR-07100KL: RES SMD 100K OHM 1% 1/16W 0402; Manufacturer 1: Yageo; Power Rating: 63mW; Resistance: 100kR; Temperature Coefficient: 100ppm/°C; Voltage Rating: 50V; Supplier 1: Digi-Key; Manufacturer Part Number 1: RC0402FR-07100KL; Stock 1: 50867324; Pricing 1: 1=0.10000, 10=0.01500, 100=0.00600, 1000=0.00270, 2500=0.00235, 5000=0.00194 (USD); RoHS: Yes; Case/Package: 0402; Case Code (Metric): 1005; Case Code (Imperial): 0402; Min Operating Temperature: -55°C; Max Operating Temperature: 155°C; Tolerance: 1%; Packaging: Tape and Reel; Composition: Thick Film; Termination: SMD/SMT; Military Standard: Not; Package Quantity: 1; Number of Terminations: 2; Max Power Dissipation: 63mW; Features: Moisture Resistant; Working Voltage: 50V; Length: 0.039inch; Height: 0.016inch; Width: 0.02inch; Depth: 0.5mm; Lead Free: Lead Free; REACH SVHC: No SVHC; ComponentLink1URL: https://datasheet.ciiva.com/11819/0900766b80c66297-11819452.pdf?src-supplier=RSComponents; ComponentLink1Description: https://datasheet.ciiva.com/11819/0900766b80c66297-11819452.pdf?src-supplier=RSComponents; ComponentLink2URL: https://datasheet.ciiva.com/2453/pyu-r-int-thick-7-2453361.pdf?src-supplier=Digi-Key; ComponentLink2Description: https://datasheet.ciiva.com/2453/pyu-r-int-thick-7-2453361.pdf?src-supplier=Digi-Key; ComponentLink3URL: https://datasheet.ciiva.com/2453/pyu-r-int-thick-7-2453362.pdf?src-supplier=Digi-Key; ComponentLink3Description: https://datasheet.ciiva.com/2453/pyu-r-int-thick-7-2453362.pdf?src-supplier=Digi-Key; ComponentLink4URL: https://datasheet.ciiva.com/2453/pyu-r-int-thick-7-2453363.pdf?src-supplier=Digi-Key; ComponentLink4Description: https://datasheet.ciiva.com/2453/pyu-r-int-thick-7-2453363.pdf?src-supplier=Digi-Key; ComponentLink5URL: https://datasheet.ciiva.com/22747/1018594-22747509.pdf?src-supplier=Element14; ComponentLink5Description: https://datasheet.ciiva.com/22747/1018594-22747509.pdf?src-supplier=Element14; ComponentLink6URL: https://datasheet.ciiva.com/15189/getdatasheetpartid-323696-15189334.pdf?src-supplier=Verical; ComponentLink6Description: https://datasheet.ciiva.com/15189/getdatasheetpartid-323696-15189334.pdf?src-supplier=Verical; ComponentLink7URL: https://datasheet.ciiva.com/12667/pyu-rc0402-51-rohs-l-6-r-12667930.pdf?src-supplier=Mouser; ComponentLink7Description: https://datasheet.ciiva.com/12667/pyu-rc0402-51-rohs-l-6-r-12667930.pdf?src-supplier=Mouser; Supplier 2: Newark; Supplier 3: Mouser; Supplier Part Number 1: 311-100KLRCT-ND; Supplier Part Number 2: 67R9887; Supplier Part Number 3: 603-RC0402FR-07100KL
R59 = CRCW0402249KFKED: RES SMD 249K OHM 1% 1/16W 0402; Manufacturer 1: Vishay; Resistance: 249kR; Temperature Coefficient: 100ppm/°C; Max Power Dissipation: 63mW; Voltage Rating (DC): 50V; Supplier 1: Digi-Key; Manufacturer Part Number 1: CRCW0402249KFKED; Stock 1: 241; Pricing 1: 1=0.10000, 10=0.03800, 100=0.01540, 1000=0.00690, 2500=0.00599, 5000=0.00495 (USD); RoHS: Yes; Case/Package: 0402; Weight: 2.3E-05oz; Case Code (Metric): 1005; Case Code (Imperial): 0402; Contact Plating: Tin; Min Operating Temperature: -55°C; Max Operating Temperature: 155°C; Tolerance: 1%; Packaging: Tape and Reel; Composition: Thick Film; Number of Terminations: 2; Package Quantity: 10; Power Rating: 63mW; Voltage Rating: 50V; Military Standard: Not; Features: Automotive AEC-Q200; Termination: SMD/SMT; Length: 1mm; Height: 0.35mm; Width: 0.02inch; Depth: 0.5mm; Lead Free: Lead Free; REACH SVHC: Unknown; ComponentLink1URL: https://datasheet.ciiva.com/11809/0900766b80d98824-11809983.pdf?src-supplier=RSComponents; ComponentLink1Description: https://datasheet.ciiva.com/11809/0900766b80d98824-11809983.pdf?src-supplier=RSComponents; ComponentLink2URL: https://datasheet.ciiva.com/22871/70201119-22871976.pdf?src-supplier=Allied+Electronics; ComponentLink2Description: https://datasheet.ciiva.com/22871/70201119-22871976.pdf?src-supplier=Allied+Electronics; ComponentLink3URL: https://datasheet.ciiva.com/22709/1697337-22709034.pdf?src-supplier=Element14; ComponentLink3Description: https://datasheet.ciiva.com/22709/1697337-22709034.pdf?src-supplier=Element14; ComponentLink4URL: https://datasheet.ciiva.com/7673/1697337-7673998.pdf?src-supplier=Element14; ComponentLink4Description: https://datasheet.ciiva.com/7673/1697337-7673998.pdf?src-supplier=Element14; ComponentLink5URL: https://datasheet.ciiva.com/2463/dcrcwe3-2463808.pdf?src-supplier=Digi-Key; ComponentLink5Description: https://datasheet.ciiva.com/2463/dcrcwe3-2463808.pdf?src-supplier=Digi-Key; ComponentLink6URL: https://datasheet.ciiva.com/2463/dcrcwe3-2463809.pdf?src-supplier=Digi-Key; ComponentLink6Description: https://datasheet.ciiva.com/2463/dcrcwe3-2463809.pdf?src-supplier=Digi-Key; ComponentLink7URL: https://datasheet.ciiva.com/5542/dcrcwe3-109170-5542680.pdf?src-supplier=Mouser; ComponentLink7Description: https://datasheet.ciiva.com/5542/dcrcwe3-109170-5542680.pdf?src-supplier=Mouser; ComponentLink8URL: https://datasheet.ciiva.com/16774/70201119-16774040.pdf?src-supplier=Allied+Electronics; ComponentLink8Description: https://datasheet.ciiva.com/16774/70201119-16774040.pdf?src-supplier=Allied+Electronics; ComponentLink9URL: https://datasheet.ciiva.com/7743/125364-7743531.pdf?src-supplier=Element14; ComponentLink9Description: https://datasheet.ciiva.com/7743/125364-7743531.pdf?src-supplier=Element14; ComponentLink10URL: https://datasheet.ciiva.com/7673/1697337-7673997.pdf?src-supplier=Element14; ComponentLink10Description: https://datasheet.ciiva.com/7673/1697337-7673997.pdf?src-supplier=Element14; Supplier 2: Digi-Key; Manufacturer 2: Vishay; Manufacturer Part Number 2: CRCW0402249KFKED; Stock 2: 241; Pricing 2: 1=0.10000, 10=0.03800, 100=0.01540, 1000=0.00690, 2500=0.00599, 5000=0.00495 (USD); Supplier Part Number 2: 541-249KLDKR-ND; Supplier Part Number 1: 541-249KLCT-ND
R60 = CRCW040239K2FKED: RES SMD 39.2K OHM 1% 1/16W 0402; Manufacturer 1: Vishay; Resistance: 39.2kR; Temperature Coefficient: 100ppm/°C; Power Rating: 63mW; Voltage Rating: 50V; Supplier 1: Digi-Key; Manufacturer Part Number 1: CRCW040239K2FKED; Stock 1: 46258; Pricing 1: 1=0.10000, 10=0.03800, 100=0.01540, 1000=0.00690, 2500=0.00599, 5000=0.00495 (USD); RoHS: Yes; Case/Package: 0402; Number of Pins: 2; Weight: 2.3E-05oz; Case Code (Imperial): 0402; Case Code (Metric): 1005; Contact Plating: Tin; Min Operating Temperature: -55°C; Max Operating Temperature: 155°C; Tolerance: 1%; Packaging: Tape and Reel; Composition: Thick Film; Number of Terminations: 2; Voltage Rating (DC): 50V; Termination: SMD/SMT; Max Power Dissipation: 63mW; Package Quantity: 10; Military Standard: Not; Features: Automotive AEC-Q200; Length: 1mm; Height: 0.35mm; Width: 0.5mm; Depth: 0.5mm; Radiation Hardening: No; Lead Free: Lead Free; REACH SVHC: Unknown; ComponentLink1URL: https://datasheet.ciiva.com/11818/0900766b80d98824-11818068.pdf?src-supplier=RSComponents; ComponentLink1Description: https://datasheet.ciiva.com/11818/0900766b80d98824-11818068.pdf?src-supplier=RSComponents; ComponentLink2URL: https://datasheet.ciiva.com/16882/dcrcwe3-16882152.pdf?src-supplier=Avnet+Europe; ComponentLink2Description: https://datasheet.ciiva.com/16882/dcrcwe3-16882152.pdf?src-supplier=Avnet+Europe; ComponentLink3URL: https://datasheet.ciiva.com/2463/dcrcwe3-2463561.pdf?src-supplier=Digi-Key; ComponentLink3Description: https://datasheet.ciiva.com/2463/dcrcwe3-2463561.pdf?src-supplier=Digi-Key; ComponentLink4URL: https://datasheet.ciiva.com/3256/dcrcwe3-3256469.pdf?src-supplier=Avnet; ComponentLink4Description: https://datasheet.ciiva.com/3256/dcrcwe3-3256469.pdf?src-supplier=Avnet; ComponentLink5URL: https://datasheet.ciiva.com/2463/dcrcwe3-2463559.pdf?src-supplier=Digi-Key; ComponentLink5Description: https://datasheet.ciiva.com/2463/dcrcwe3-2463559.pdf?src-supplier=Digi-Key; ComponentLink6URL: https://datasheet.ciiva.com/2463/dcrcwe3-2463560.pdf?src-supplier=Digi-Key; ComponentLink6Description: https://datasheet.ciiva.com/2463/dcrcwe3-2463560.pdf?src-supplier=Digi-Key; ComponentLink7URL: https://datasheet.ciiva.com/16774/70201119-16774809.pdf?src-supplier=Allied+Electronics; ComponentLink7Description: https://datasheet.ciiva.com/16774/70201119-16774809.pdf?src-supplier=Allied+Electronics; ComponentLink8URL: https://datasheet.ciiva.com/22869/70201119-22869593.pdf?src-supplier=Allied+Electronics; ComponentLink8Description: https://datasheet.ciiva.com/22869/70201119-22869593.pdf?src-supplier=Allied+Electronics; ComponentLink9URL: https://datasheet.ciiva.com/16429/dcrcwe3-16429962.pdf?src-supplier=Future+Electronics; ComponentLink9Description: https://datasheet.ciiva.com/16429/dcrcwe3-16429962.pdf?src-supplier=Future+Electronics; ComponentLink10URL: https://datasheet.ciiva.com/7671/1697337-7671596.pdf?src-supplier=Element14; ComponentLink10Description: https://datasheet.ciiva.com/7671/1697337-7671596.pdf?src-supplier=Element14; ComponentLink11URL: https://datasheet.ciiva.com/7671/1533075-7671772.pdf?src-supplier=Element14; ComponentLink11Description: https://datasheet.ciiva.com/7671/1533075-7671772.pdf?src-supplier=Element14; Supplier Part Number 1: 541-39.2KLCT-ND
R62 = CMP-013-000014-8: RES SMD 30K OHM 1% 1/16W 0402; Manufacturer 1: Yageo; Voltage Rating: 50V; Power Rating: 62.5mW; Design Item ID: RC0402FR-0730KL; Tolerance: 1%; Min Operating Temperature: -55°C; Manufacturer Part Number 1: RC0402FR-0730KL; Max Operating Temperature: 155°C
R64 R69 = RC0402FR-1310KL: RES SMD 10K OHM 1% 0402 1/16W Chip Resistor, 0402 [1005 Metric], 10 kohm, RC Series, 50 V, Thick Film, 62.5 mW; Manufacturer 1: Yageo; Resistance: 10kR; Temperature Coefficient: 100ppm/°C; Power Rating: 62.5mW; Voltage Rating: 50V; ComponentLink1URL: https://datasheet.ciiva.com/16940/pyu-rc0402-51-rohs-l-6-16940293.pdf?src-supplier=Avnet+Europe; ComponentLink1Description: https://datasheet.ciiva.com/16940/pyu-rc0402-51-rohs-l-6-16940293.pdf?src-supplier=Avnet+Europe; ComponentLink2URL: https://datasheet.ciiva.com/28386/pyu-rc0402-51-rohs-l-6-28386855.pdf?src-supplier=Avnet+Europe; ComponentLink2Description: https://datasheet.ciiva.com/28386/pyu-rc0402-51-rohs-l-6-28386855.pdf?src-supplier=Avnet+Europe; ComponentLink3URL: https://datasheet.ciiva.com/16740/pyu-rc0402-51-rohs-l-6-r-16740602.pdf?src-supplier=Future+Electronics; ComponentLink3Description: https://datasheet.ciiva.com/16740/pyu-rc0402-51-rohs-l-6-r-16740602.pdf?src-supplier=Future+Electronics; ComponentLink4URL: https://datasheet.ciiva.com/8891/pyu-rc0402-51-rohs-l-6-8891339.pdf?src-supplier=Avnet; ComponentLink4Description: https://datasheet.ciiva.com/8891/pyu-rc0402-51-rohs-l-6-8891339.pdf?src-supplier=Avnet; ComponentLink5URL: https://datasheet.ciiva.com/5557/pyu-rc0402-51-rohs-l-6-r-5557997.pdf?src-supplier=Mouser; ComponentLink5Description: https://datasheet.ciiva.com/5557/pyu-rc0402-51-rohs-l-6-r-5557997.pdf?src-supplier=Mouser; ComponentLink6URL: https://datasheet.ciiva.com/7983/1018594-7983533.pdf?src-supplier=Element14; ComponentLink6Description: https://datasheet.ciiva.com/7983/1018594-7983533.pdf?src-supplier=Element14; Supplier 1: Newark; Manufacturer Part Number 1: RC0402FR-1310KL; Stock 1: 62239; Pricing 1: 1=0.10000, 25=0.01200, 100=0.00400, 250=0.00400, 500=0.00300, 1000=0.00300 (USD); RoHS: Yes; Case/Package: 0402; Number of Pins: 2; Contact Plating: Tin,Matte,Lead; Case Code (Imperial): 0402; Case Code (Metric): 1005; Min Operating Temperature: -55°C; Max Operating Temperature: 155°C; Tolerance: 1%; Composition: Thick Film; Packaging: Tape and Reel; Termination: SMD/SMT; Military Standard: Not; Voltage Rating (DC): 50V; Working Voltage: 50V; Number of Terminations: 2; Length: 1mm; Depth: 0.5mm; Radiation Hardening: No; REACH SVHC: No SVHC; Lead Free: Lead Free; Supplier Part Number 1: 67R9960; Supplier 2: Future Electronics; Supplier 3: Mouser; Supplier 4: Element14; Supplier Part Number 2: RC0402FR-1310KL-CUTT; Supplier Part Number 3: 603-RC0402FR-1310KL; Supplier Part Number 4: 1799235
R65 = CMP-102-000000-1: RES SMD 12.1K OHM 1% 1/16W 0402; Manufacturer 1: Yageo; Additional Feature: LASER TRIMMABLE; Package Width: 0.5mm; Temperature Coefficient: 100ppm/°C; Rated Power Dissipation (P): 62.5mW; Package Height: 0.35mm; Package Length: 1mm; Working Voltage: 50V; Rated Temperature: 70°C; Source: NG2391C-HM.SchLib; Category: Chip SMD Resistors; Design Item ID: RC0402FR-0712K1L; Package Style: SMTMeter; ComponentLink7Description: https://datasheet.ciiva.com/17070/pyu-rc0402-51-rohs-l-6-r-17070757.pdf?src-supplier=Future+Electronics; Manufacturer Part Number 1: RC0402FR-0712K1L; ComponentLink6URL: https://datasheet.ciiva.com/2453/pyu-r-int-thick-7-2453487.pdf?src-supplier=Digi-Key; ComponentLink7URL: https://datasheet.ciiva.com/17070/pyu-rc0402-51-rohs-l-6-r-17070757.pdf?src-supplier=Future+Electronics; ComponentLink2URL: https://datasheet.ciiva.com/11808/0900766b80d8d3b8-11808222.pdf?src-supplier=RSComponents; Stock 1: 60000; ComponentLink6Description: https://datasheet.ciiva.com/2453/pyu-r-int-thick-7-2453487.pdf?src-supplier=Digi-Key; Construction: Chip; Max Operating Temperature: 155°C; ComponentLink4Description: https://datasheet.ciiva.com/2453/pyu-r-int-thick-7-2453489.pdf?src-supplier=Digi-Key; ComponentLink1URL: https://datasheet.ciiva.com:443/pdfs/VipMasterIC/IC/YAGO/YAGO-S-A0008145938/YAGO-S-A0008145938-1.pdf?src-supplier=IHS+Markit; ComponentLink2Description: https://datasheet.ciiva.com/11808/0900766b80d8d3b8-11808222.pdf?src-supplier=RSComponents; RoHS: Yes; ComponentLink4URL: https://datasheet.ciiva.com/2453/pyu-r-int-thick-7-2453489.pdf?src-supplier=Digi-Key; Packaging: Tape and Reel; Resistor Type: FIXED RESISTOR; REACH SVHC: Yes; ComponentLink5Description: https://datasheet.ciiva.com/7983/1018594-7983493.pdf?src-supplier=Element14; Tolerance: 1%; Technology: METAL GLAZE/THICK FILM; ComponentLink5URL: https://datasheet.ciiva.com/7983/1018594-7983493.pdf?src-supplier=Element14; Mount: Surface Mount; Pricing 1: 10000=0,00090, 20000=0,00088, 40000=0,00086, 60000=0,00084, 80000=0,00081, 100000=0,00079, 1000000=0,00077 (USD); ComponentLink1Description: https://datasheet.ciiva.com:443/pdfs/VipMasterIC/IC/YAGO/YAGO-S-A0008145938/YAGO-S-A0008145938-1.pdf?src-supplier=IHS+Markit; Number of Pins: 2; ComponentLink3URL: https://datasheet.ciiva.com/2453/pyu-r-int-thick-7-2453488.pdf?src-supplier=Digi-Key; ComponentLink3Description: https://datasheet.ciiva.com/2453/pyu-r-int-thick-7-2453488.pdf?src-supplier=Digi-Key; Package Shape: Rectangular; Min Operating Temperature: -55°C; JESD-609 Code: e3; Terminal Finish: Nickel; RoHS Compliant: Yes; Termination: Wraparound